# EAGLE design LMH6629_test (EAGLE 8.4.3)
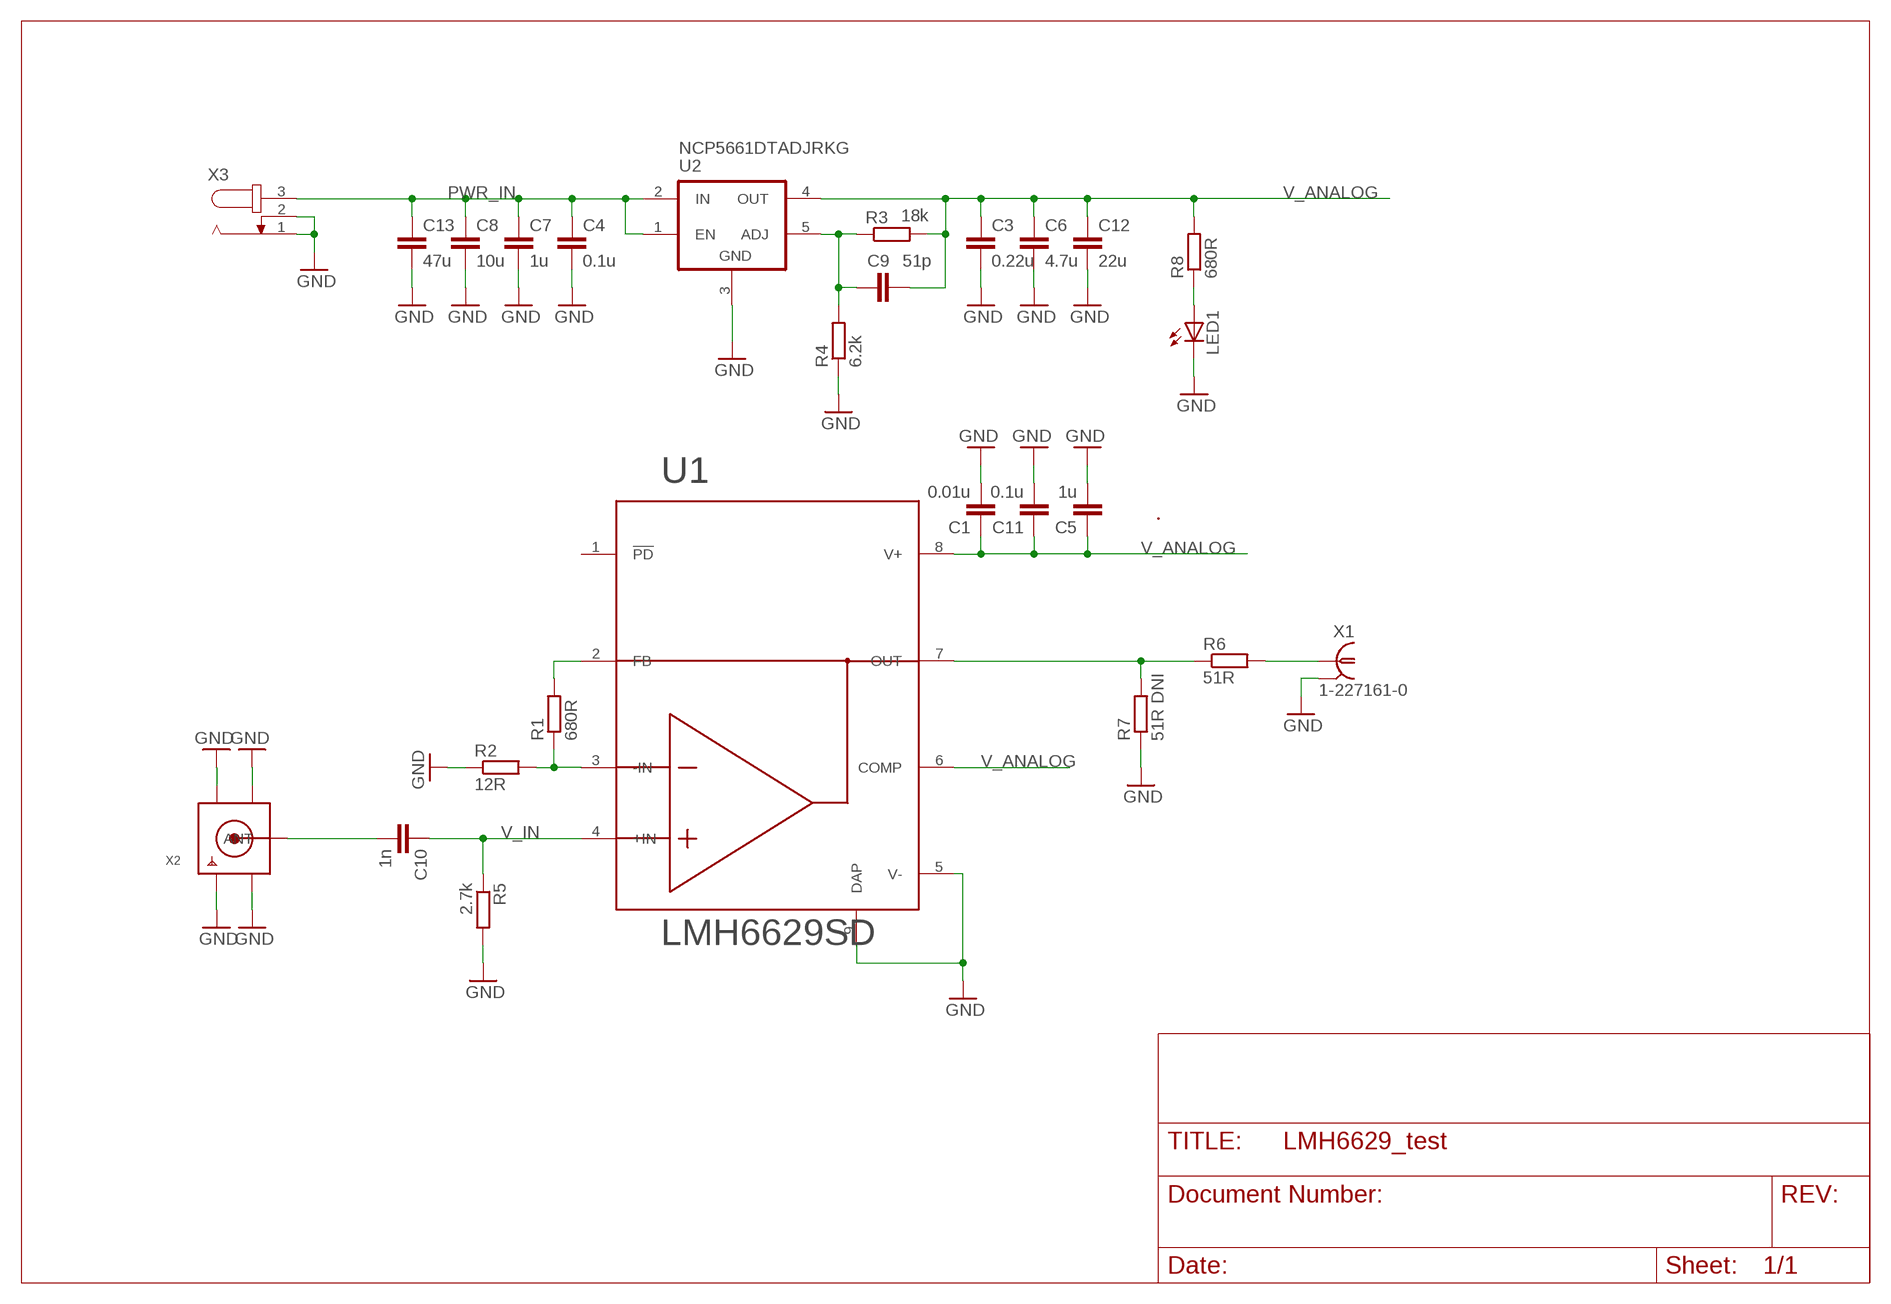
[diagram p0: schematic, sheet 1]

## Parts
C1  0.01u  C-EUC0603  [C0603]
C3  0.22u  C-EUC0603  [C0603]
C4  0.1u  C-EUC0603  [C0603]
C5  1u  C-EUC0603  [C0603]
C6  4.7u  C-EUC0805  [C0805]
C7  1u  C-EUC0603  [C0603]
C8  10u  C-EUC0805  [C0805]
C9  51p  C-EUC0603  [C0603]
C10  1n  C-EUC0603  [C0603]
C11  0.1u  C-EUC0603  [C0603]
C12  22u  C-EUC0805  [C0805]
C13  47u  C-EUC1210  [C1210]
LED1  LEDCHIPLED_0603  [CHIPLED_0603]
R1  680R  R-EU_R0402  [R0402]
R2  12R  R-EU_R0402  [R0402]
R3  18k  R-EU_R0603  [R0603]
R4  6.2k  R-EU_R0603  [R0603]
R5  2.7k  R-EU_R0603  [R0603]
R6  51R  R-EU_R0603  [R0603]
R7  51R DNI  R-EU_R0603  [R0603]
R8  680R  R-EU_R0603  [R0603]
U1  LMH6629SD  [SON50P300X300X100-9N]
U2  NCP5661DTADJRKG  [DPAK-5]
X1  1-227161-0  [AMP_227161]
X2  SMACONNECTOR_EDGE  [SMA_EDGELAUNCH]
X3  JACK-PLUG1  [SPC4078]

## Nets
-IN: R1.1 R2.2 U1.3(-IN)
ADJ: C9.1 R3.1 R4.2 U2.5(ADJ)
FB: R1.2 U1.2(FB)
GND: C1.2 C3.2 C4.2 C5.2 C6.2 C7.2 C8.2 C11.2 C12.2 C13.2 LED1.C R2.1 R4.1 R5.2 R7.1 U1.5(V-) U1.9(DAP) U2.3(GND) X1.2 X2.GND@1(GND4) X2.GND@2(GND3) X2.GND@3(GND2) X2.GND@4(GND1) X3.1 X3.2
N$1: LED1.A R8.1
N$3: C10.2 X2.P(ANT)
OUT: R6.2 X1.1
PWR_IN: C4.1 C7.1 C8.1 C13.1 U2.1(EN) U2.2(IN) X3.3
V_ANALOG: C1.1 C3.1 C5.1 C6.1 C9.2 C11.1 C12.1 R3.2 R8.2 U1.6(COMP) U1.8(V+) U2.4(OUT)
V_IN: C10.1 R5.1 U1.4(+IN)
V_OUT: R6.1 R7.2 U1.7(OUT)
Unconnected: U1.1(!PD)

## Library data of the parts
C1 C3-C12 = rcl:C-EU: CAPACITOR, European symbol
C13 = resistor:C-EU: CAPACITOR, European symbol
LED1 = adafruit:LED: LED OSRAM: - CHIPLED LG R971, LG N971, LY N971, LG Q971, LY Q971, LO R971, LY R971 LH N974, LH R974 LS Q976, LO Q976, LY Q976 LO Q996 - Hyper CHIPLED LW Q18S LB Q993, LB Q99A, LB R99A - SideLED LS A670, LO A670, LY A670, LG A670, LP A670 LB A673, LV A673, LT A673, LW A673 LH A674 LY A675 LS A676, LA A676, LO A676, LY A676, LW A676 LS A679, LY A679, LG A679 - Hyper Micro SIDELED® LS Y876, LA Y876, LO Y876, LY Y876 LT Y87S - SmartLED LW L88C, LW L88S LB L89C, LB L89S, LG L890 LS L89K, LO L89K, LY L89K LS L896, LA L896, LO L896, LY L896 - TOPLED LS T670, LO T670, LY T670, LG T670, LP T670 LSG T670, LSP T670, LSY T670, LOP T670, LYG T670 LG T671, LOG T671, LSG T671 LB T673, LV T673, LT T673, LW T673 LH T674 LS T676, LA T676, LO T676, LY T676, LB T676, LH T676, LSB T676, LW T676 LB T67C, LV T67C, LT T67C, LS T67K, LO T67K, LY T67K, LW E67C LS E67B, LA E67B, LO E67B, LY E67B, LB E67C, LV E67C, LT E67C LW T67C LS T679, LY T679, LG T679 LS T770, LO T770, LY T770, LG T770, LP T770 LB T773, LV T773, LT T773, LW T773 LH T774 LS E675, LA E675, LY E675, LS T675 LS T776, LA T776, LO T776, LY T776, LB T776 LHGB T686 LT T68C, LB T68C - Hyper Mini TOPLED® LB M676 - Mini TOPLED Santana® LG M470 LS M47K, LO M47K, LY M47K Source: http://www.osram.convergy.de/
R1-R8 = resistor:R-EU_: RESISTOR, European symbol
U1 = Texas Instruments_By_element14_Batch_1:LMH6629SD
U2 = on-semi:NCP5661DTADJRKG
X1 = con-coax:?227161*: JACK, RIGHT ANGLE, 50 OHM, PCB, BNC Source: amp_227161.pdf; MF: TYCO ELECTRONICS; MPN: 1-227161; OC_FARNELL: unknown; OC_NEWARK: 33B3200
X2 = adafruit:SMACONNECTOR: SMA Connector 90° DIP SMA Connector, 50 Ohm (4UConnector: 07259)
X3 = con-jack:JACK-PLUG: DC POWER JACK Power Jack, DC, Right Angle, Through Hole, Rated 5A at 16VDC, PC Terminals Distributor: Farnell (www.Farnell.de) Drawing: 84N1161.pdf / 84N1162.pdf Manufacturer: SPC Technology (www.spctechnology.com) Type: SPC4077 / SPC 4078; OC_FARNELL: unknown; OC_NEWARK: unknown

## Board
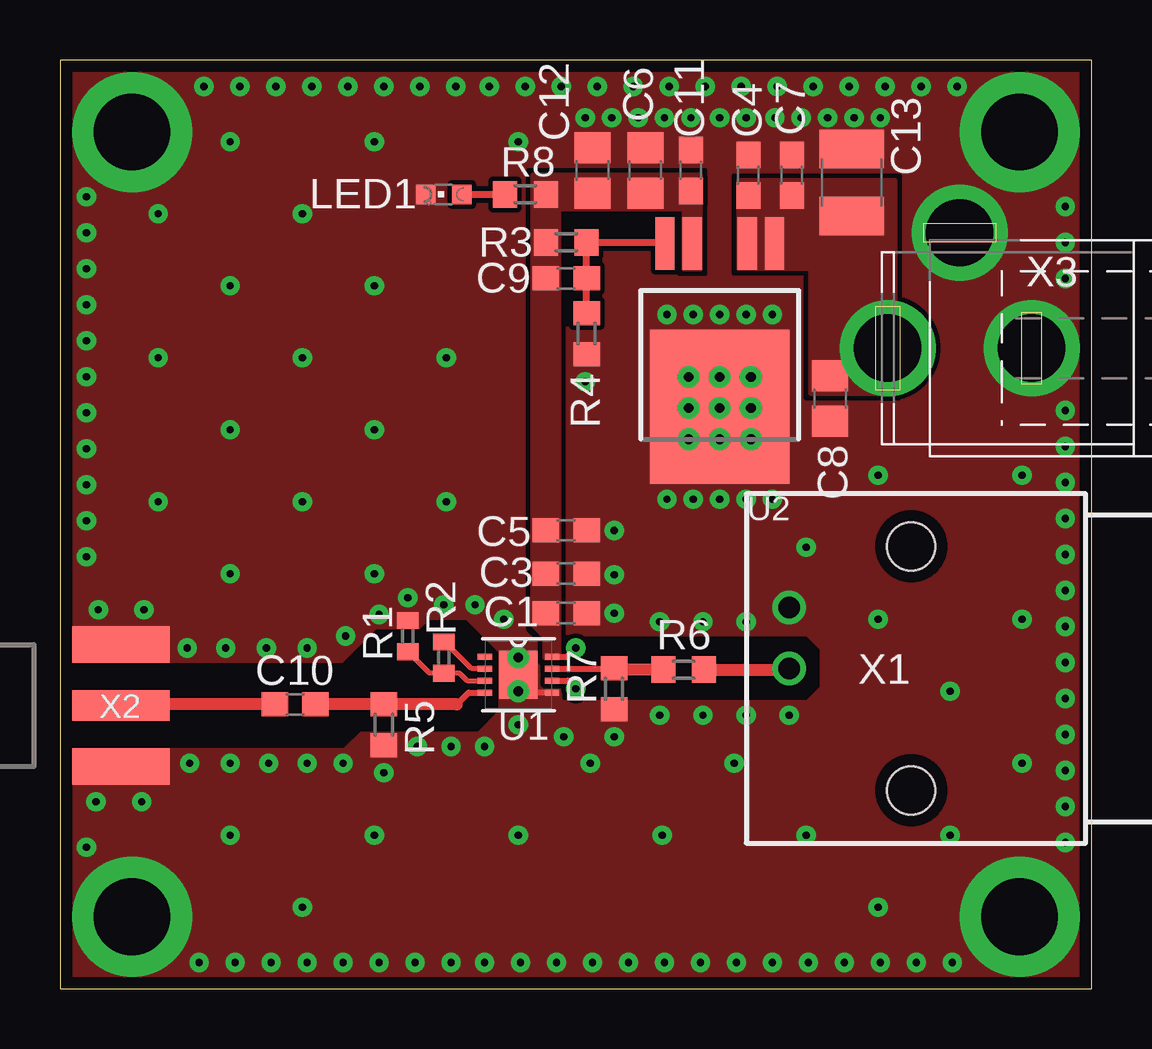
[diagram p1: board, top side]
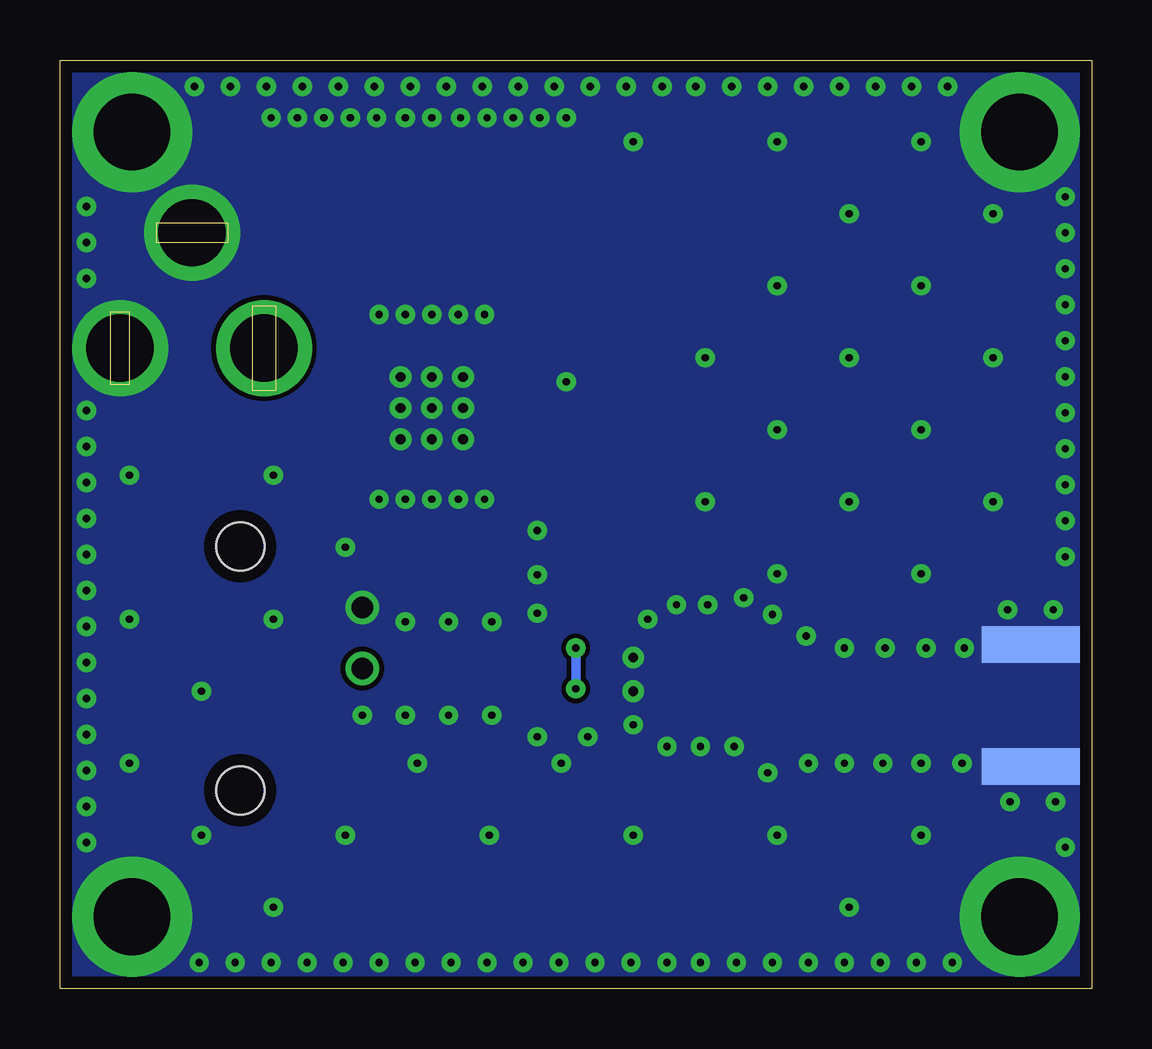
[diagram p2: board, bottom side, seen from below]

Size 43 x 38.7 mm. Coordinates in mm from the lower left corner, seen from the top.
Outline: 0,0 43,0 43,38.7 0,38.7 0,0
Copper layers (1*16): Top 0.035mm / dielectric 1.5mm / Bottom 0.035mm
Design rules "default *": minimum track width 0.2mm, minimum drill 0.3mm, track to track 0.2mm, track to pad 0.2mm, pad to pad 0.2mm, via to via 0.2mm, smd to smd 0.2mm, copper to edge 0.5mm, drill to drill 0.18mm, minimum pad ring 10mil, minimum via ring 8mil, stop-mask expansion 0.04mm, vias tented up to drill 0.3mm, thermal gap 10mil
tRestrict: area 0.1,10.1 to 18.2,15.3; area 21,12.1 to 31.6,14.6

### Footprints (pad centres in the part's own frame; a part is rotated, then mirrored left to right if it is on the bottom)
C0603 = smd 1.1 x 1: 1 -0.85,0; 2 0.85,0
C0805 = smd 1.3 x 1.5: 1 -0.95,0; 2 0.95,0
C1210 = smd 1.6 x 2.7: 1 -1.4,0; 2 1.4,0
CHIPLED_0603 = smd 0.8 x 0.8: A 0,-0.75; C 0,0.75
R0402 = smd 0.7 x 0.9: 1 -0.65,0; 2 0.65,0
R0603 = smd 1 x 1.1: 1 -0.85,0; 2 0.85,0
SON50P300X300X100-9N = smd 0.6 x 0.25: 1 -1.4,0.75; 2 -1.4,0.25; 3 -1.4,-0.25; 4 -1.4,-0.75; 5 1.4,-0.75; 6 1.4,-0.25; 7 1.4,0.25; 8 1.4,0.75 | smd 1.6 x 2: 9 0,0
DPAK-5 = smd 0.8 x 2.2: 1 -2.286,-6.858; 2 -1.143,-6.858; 4 1.143,-6.858; 5 2.286,-6.858 | smd 5.8 x 6.4: 3 0,-0.052
AMP_227161 = drill 0.9 pad 1.27: 1 0,-5.08; 2 -2.54,-5.08 | hole 2: -5.08,0; 5.08,0
SMA_EDGELAUNCH = smd 4.064 x 1.524: GND@1 2.032,-2.54; GND@2 2.032,2.54 | smd 4.064 x 1.524 bottom: GND@3 2.032,2.54; GND@4 2.032,-2.54 | smd 4.064 x 1.27: P 2.032,0
SPC4078 = drill 2.8 pad 4: 1 -3,0; 2 0,-4.8; 3 3,0

### Placement (x,y rotation side)
C1  21.1,15.65 0 top
C3  21.1,17.3 0 top
C4  28.7,33.9 90 top
C5  21.1,19.1 0 top
C6  24.4,34.1 90 top
C7  30.5,33.9 90 top
C8  32.1,24.6 270 top
C9  21.1,29.6 180 top
C10  9.8,11.85 180 top
C11  26.3,34.1 90 top
C12  22.2,34.1 90 top
C13  33,33.6 90 top
LED1  16,33.1 90 top
R1  16,13.8 90 top
R2  14.5,14.7 270 top
R3  21.1,31.1 180 top
R4  21.95,27.3 90 top
R5  13.5,11 270 top
R6  26,13.3 0 top
R7  23.1,12.5 90 top
R8  19.4,33.1 0 top
U1  19.11,13.09 0 top
U2  27.5,24.2 180 top
X1  35.48,13.35 270 top
X2  0.5,11.8 0 top
X3  37.5,26.7 180 top

### Tracks (layer width: path | path; a pad name or v marks a point on that pad's centre or on a via)
-IN
  Top 0.2: U1.3 16.96,12.84 16.65,13.15 R1.1 15.4,13.15 R2.2
ADJ
  Top 0.3: U2.5 25.17,31.1 R3.1 21.9,31.05 21.95,31 C9.1 R4.2
FB
  Top 0.2: U1.2 17.16,13.34 16.05,14.45 R1.2
GND  (via drill 0.3 pad 0.8, 0.4 pad 0.9, 3.2 pad 5)
  Top 0.2: 19.86,12.34 U1.9
  Top 0.25: U1.5 19.86,12.34
  other vias: 19.1,13.8 19.1,12.4 14.9,10.1 11.8,9.4 8.7,9.4 10.3,9.4 17.7,10.1 23.1,15.65 23.1,10.5 25,15.3 17.3,16 16,16 13.5,9 3.4,7.8 1.5,7.8 7.1,9.4 5.4,9.4 13.3,15.6 1.1,33 19.1,11 21,10.5 18.5,15.4 26.4,20.4 25.3,20.4 26.3,36.3 29.8,36.3 28.6,36.3 32,36.3 10.3,14.2 11.9,14.7 30.9,36.3 3,3 40,3 3,35.7 40,35.7 14.5,16.3 33.1,36.3 34.2,36.3 25.2,36.3 21.9,25.3 24.1,36.3 23,36.3 27.5,36.3 23.1,17.25 23.1,19.1 27.5,20.4 28.6,20.4 29.7,20.4 26.2,25.5 27.5,25.5 27.5,24.2 26.2,24.2 28.8,25.5 28.8,24.2 26.2,22.9 27.5,22.9 28.8,22.9 26.4,28.1 25.3,28.1 27.5,28.1 28.6,28.1 29.7,28.1 16.3,10.1 5.3,14.2 6.9,14.2 8.6,14.2 3.5,15.8 1.6,15.8 26.8,15.3 28.6,15.3 28.6,11.4 1.1,31.5 1.1,30 1.1,28.5 1.1,27 1.1,25.5 1.1,24 1.1,22.5 1.1,21 1.1,19.5 1.1,18 1.1,5.9 5.8,1.1 7.3,1.1 8.8,1.1 10.3,1.1 11.8,1.1 13.3,1.1 14.8,1.1 16.3,1.1 17.7,1.1 19.2,1.1 20.7,1.1 22.2,1.1 23.7,1.1 25.2,1.1 26.7,1.1 28.2,1.1 29.7,1.1 31.2,1.1 32.7,1.1 34.2,1.1 35.7,1.1 37.2,1.1 6,37.6 7.5,37.6 9,37.6 10.5,37.6 12,37.6 13.5,37.6 15,37.6 16.5,37.6 17.9,37.6 19.4,37.6 20.9,37.6 22.4,37.6 23.9,37.6 25.4,37.6 26.9,37.6 28.4,37.6 29.9,37.6 31.4,37.6 32.9,37.6 34.4,37.6 35.9,37.6 37.4,37.6 25,11.4 26.8,11.4 41.9,21.1 41.9,19.6 41.9,18.1 41.9,16.6 41.9,15.1 41.9,13.6 41.9,12.1 41.9,10.6 41.9,9.1 41.9,7.6 41.9,6.1 41.9,32.6 41.9,31.1 41.9,29.6 41.9,22.6 41.9,24.1 30.4,11.4 4.1,20.3 4.1,26.3 7.1,29.3 7.1,23.3 4.1,32.3 10.1,26.3 10.1,32.3 10.1,20.3 7.1,17.3 13.1,17.3 13.1,23.3 13.1,29.3 13.1,35.3 7.1,35.3 19.1,35.3 16.1,26.3 16.1,20.3 7.1,6.4 13.1,6.4 10.1,3.4 19.1,6.4 25.1,6.4 31.1,6.4 34.1,3.4 28.1,9.4 37.1,6.4 40.1,9.4 37.1,12.4 40.1,15.4 34.1,15.4 31.1,18.4 34.1,21.4 40.1,21.4 22.1,9.4 21.9,36.3
  pour Top (rank 2, no thermals): -0.2,39 -0.1,-0.2 43.2,0 43.2,39
  pour Bottom (no thermals): -0.4,39.5 -0.4,-0.4 43.3,-0.4 43.3,39.5
N$1
  Top 0.3: LED1.A R8.1
N$3
  Top 0.5: C10.2 2.58,11.85 X2.P
OUT
  Top 0.5: R6.2 30.35,13.3 X1.1
PWR_IN
  pour Top (no thermals): 28.3,33.7 34.8,33.7 34.8,24.8 31.3,24.8 31.3,30 28.3,30
V_ANALOG  (via drill 0.3 pad 0.8)
  Top 0.25: U1.8 21.14,13.84 v21.5,14.2 | U1.6 21.16,12.84 v21.5,12.5
  Bottom 0.4: v21.5,14.2 v21.5,12.5
  pour Top (no thermals): 19.7,33.9 19.7,15.2 20.2,14.7 20.2,13.8 20.8,13.8 20.8,32.5 26,32.5 26,30 26.7,30 26.7,33.9
V_IN
  Top 0.25: U1.4 17.04,12.34 16.55,11.85
  Top 0.5: 16.55,11.85 R5.1 C10.1
V_OUT
  Top 0.25: U1.7 R7.2
  Top 0.5: R6.1 23.15,13.3 R7.2

### Text on the board
tStop: LMH6629 test pcb